# EasyEDA Pro project ProDoc_SAMID_2026-04-18.epro

# Schematic SAMID
Board Name: SAMID; Create Date: 2025-04-14; Page Name: SAMID; Project Name: SAMID_2025-04-14_12-44-47; Schematic Name: SAMID; Update Date: 2025-04-20; Add into BOM: yes; Company: Your Company; Convert to PCB: yes; Date: 2025-02-18; Draw By: jajasaludosjoselol; REV: 1.0; Sheet: 1/1; spicePre: .
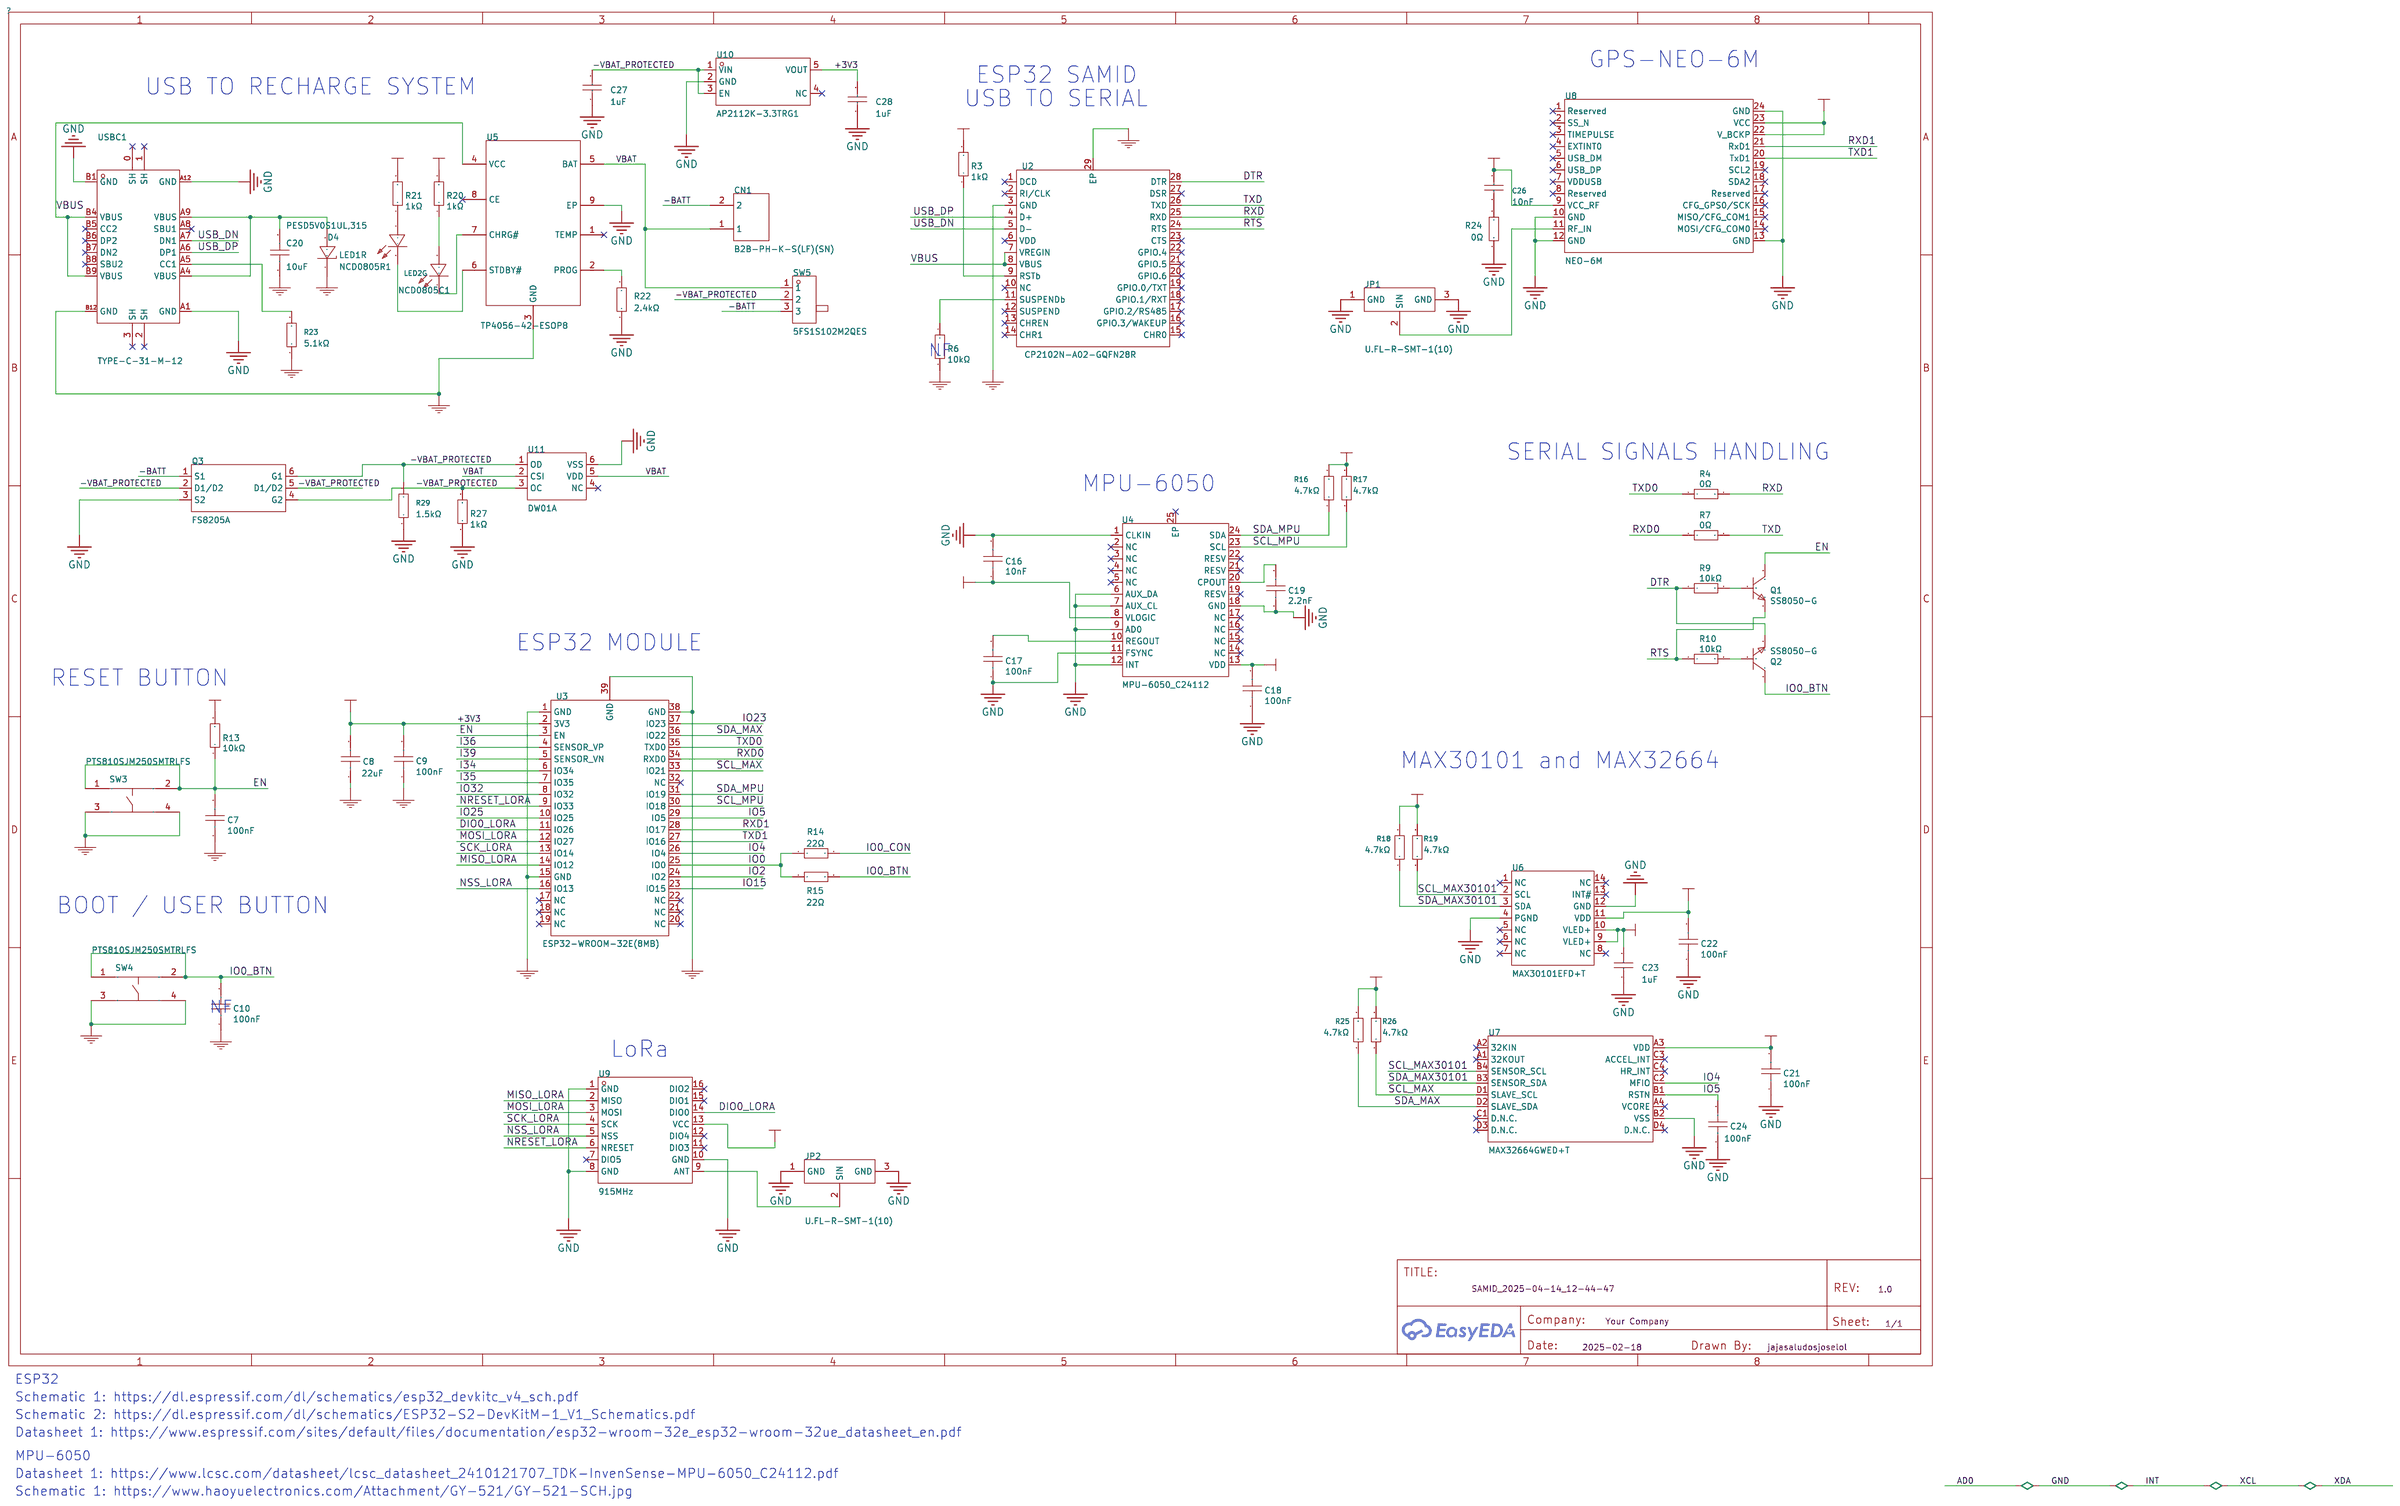
[diagram p0: schematic sheet]

## Parts
C7  100nF  [C0402]
C8  22uF  [C0805]
C9  100nF  [C0402]
C10  100nF  [C0402]
C16  10nF  [C0402]
C17  100nF  [C0402]
C18  100nF  [C0402]
C19  2.2nF  [C0402]
C20  10uF  [C0805]
C21  100nF  [C0402]
C22  100nF  [C0402]
C23  1uF  [C0603]
C24  100nF  [C0402]
C26  10nF  [C0603]
C27  1uF  [C0603]
C28  1uF  [C0603]
CN1  B2B-PH-K-S(LF)(SN)  [CONN-TH_B2B-PH-K-S]
D4  PESD5V0S1UL,315  [SOD-882_L1.0-W0.6-RD]
JP1  U.FL-R-SMT-1(10)  [ANT-SMD_UFL-R-SMT-1-10]
JP2  U.FL-R-SMT-1(10)  [ANT-SMD_UFL-R-SMT-1-10]
LED1R  NCD0805R1  [LED0805-R-RD]
LED2G  NCD0805C1  [LED0805-RD]
Q1  SS8050-G  [SOT-23-3_L2.9-W1.3-P1.90-LS2.4-BR]
Q2  SS8050-G  [SOT-23-3_L2.9-W1.3-P1.90-LS2.4-BR]
Q3  FS8205A  [SOT-23-6_L2.9-W1.6-P0.95-LS2.8-BR]
R3  1kΩ  [R0402]
R4  0Ω  [R0402]
R6  10kΩ  [R0402]
R7  0Ω  [R0402]
R9  10kΩ  [R0402]
R10  10kΩ  [R0402]
R13  10kΩ  [R0402]
R14  22Ω  [R0402]
R15  22Ω  [R0402]
R16  4.7kΩ  [R0402]
R17  4.7kΩ  [R0402]
R18  4.7kΩ  [R0402]
R19  4.7kΩ  [R0402]
R20  1kΩ  [R0402]
R21  1kΩ  [R0402]
R22  2.4kΩ  [R0402]
R23  5.1kΩ  [R0402]
R24  0Ω  [R0402]
R25  4.7kΩ  [R0402]
R26  4.7kΩ  [R0402]
R27  1kΩ  [R0402]
R29  1.5kΩ  [R0805]
SW3  PTS810SJM250SMTRLFS  [KEY-SMD_4P-L4.2-W3.2-P2.20-LS4.6]
SW4  PTS810SJM250SMTRLFS  [KEY-SMD_4P-L4.2-W3.2-P2.20-LS4.6]
SW5  5FS1S102M2QES  [SW-TH_5FS1S102M2QES]
U2  CP2102N-A02-GQFN28R  [QFN-28_L5.0-W5.0-P0.50-TL-EP3.3]
U3  ESP32-WROOM-32E(8MB)  [WIFI-SMD_ESP32-WROOM-32E]
U4  MPU-6050_C24112  [QFN-24_L4.0-W4.0-P0.50-TL-EP2.5_B04217]
U5  TP4056-42-ESOP8  [ESOP-8_L4.9-W3.9-P1.27-LS6.0-BL-EP]
U6  MAX30101EFD+T  [OESIP-14_L5.6-W3.3-P0.80-TL]
U7  MAX32664GWED+T  [WLP-16_L1.6-W1.6-R4-C4-P0.35-TL_MAX32664GWEA]
U8  NEO-6M  [GPSM-SMD_24P-L16.0-W12.2-P1.10]
U9  915MHz  [COMM-SMD_LORA1276-C1-915MHZ]
U10  AP2112K-3.3TRG1  [SOT-25-5_L2.9-W1.6-P0.95-LS2.8-BL]
U11  DW01A  [SOT-23-6_L2.9-W1.6-P0.95-LS2.8-BL]
USBC1  TYPE-C-31-M-12  [USB-C_SMD-TYPE-C-31-M-12]

## Library data of the parts
C7 C9 C10 C21 C22 C24 = 100nF: Supplier: LCSC; Manufacturer Part: CL05B104KO5NNNC; Manufacturer: SAMSUNG(三星); Supplier Part: C1525; JLCPCB Part Class: Basic Part; nameAlias: Value; spicePre: C; spiceSymbolName: CL05B104KO5NNNC
C8 = 22uF: Supplier: LCSC; Supplier Part: C602037; Manufacturer: SAMSUNG(三星); Manufacturer Part: CL21A226MAYNNNE; JLCPCB Part Class: Extended Part; nameAlias: Value; Contributor: LCSC; spicePre: C; spiceSymbolName: CL21A226MAYNNNE
C16 = 10nF: Supplier: LCSC; Supplier Part: C541370; Manufacturer: YAGEO(国巨); Manufacturer Part: CC0402KRX7R5BB103; JLCPCB Part Class: Extended Part; nameAlias: Value; Contributor: shahariyarmaraz; spicePre: C; spiceSymbolName: CC0402KRX7R5BB103
C17 C18 = 100nF: Supplier: LCSC; Manufacturer Part: CC0402KRX7R5BB104; Manufacturer: YAGEO(国巨); Supplier Part: C541406; JLCPCB Part Class: Extended Part; nameAlias: Value; Contributor: LCSC; spicePre: C; spiceSymbolName: CC0402KRX7R5BB104
C19 = 2.2nF: Supplier: LCSC; Supplier Part: C526947; Manufacturer: YAGEO(国巨); Manufacturer Part: CC0201KRX7R5BB222; JLCPCB Part Class: Extended Part; nameAlias: Value; Contributor: LCSC; spicePre: C; spiceSymbolName: CC0201KRX7R5BB222
C20 = CL21A106KAYNNNE_C15850: Capacitance: Tolerance:±10% Tolerance:±10% Voltage Rated: Temperature Coefficient:; LCSC Part Name: 10uF ±10% 25V; Supplier Part: C15850; Manufacturer: SAMSUNG(三星); Manufacturer Part: CL21A106KAYNNNE; Supplier Footprint: 0805; JLCPCB Part Class: Basic Part; Datasheet: https://atta.szlcsc.com/upload/public/pdf/source/20160218/1457707763339.pdf; Supplier: LCSC; Tolerance: ±10%
C23 C27 C28 = CL10A105KA8NNNC: Capacitance: Tolerance:±10% Tolerance:±10% Voltage Rated: Temperature Coefficient:; LCSC Part Name: 1uF ±10% 25V; Supplier Part: C5673; Manufacturer: SAMSUNG(三星); Supplier Footprint: 0603; JLCPCB Part Class: Extended Part; Datasheet: https://atta.szlcsc.com/upload/public/pdf/source/20160218/1457707763339.pdf; Supplier: LCSC; Tolerance: ±10%
C26 = CC0603KRX7R9BB103: Capacitance: Tolerance:±10% Tolerance:±10% Voltage Rated: Temperature Coefficient:; LCSC Part Name: 10nF ±10% 50V; Supplier Part: C100042; Manufacturer: YAGEO(国巨); Supplier Footprint: 0603; Datasheet: https://atta.szlcsc.com/upload/public/pdf/source/20181008/C309510_22F155564471FAF6A489F7D68F34234E.pdf; Supplier: LCSC; Tolerance: ±10%
CN1 = B2B-PH-K-S(LF)(SN): Pins Structure:1x2P Pitch:2mm Mounting Type:Direct Insert Reference Series:PH Number of Pins:2P Number of Rows:1 Number of PINs Per Row:2 Row Spacing:- Current Rating:2A Contact Material:Brass Contact Plating:Tin Operating Temperature:-25℃~+85℃ Operating; LCSC Part Name: 1x2P 间距:2mm 直插 系列:PH; Supplier Part: C131337; Manufacturer: JST; Supplier Footprint: 插件,P=2mm; JLCPCB Part Class: Extended Part; Datasheet: https://atta.szlcsc.com/upload/public/pdf/source/20171026/C131342_15089839687311058815.pdf; Supplier: LCSC; Pins Structure: 1x2P; Pitch: 2mm; Mounting Type: Direct Insert; Reference Series: PH; Number of Pins: 2P; Number of Rows: 1; Number of PINs Per Row: 2; Current Rating: 2A; Contact Material: Brass; Contact Plating: Tin; Operating Temperature: -25℃~+85℃; Voltage Rating: 100V; Plastic Material: PA66; Flame Retardant Rating: UL94V-0; Supplementary Features: K-leg punch; Color: White; Z-Height of the Board: 6mm; X-Length of Bottom Edge on Board (Spacing Line): 5.9mm; Y-Width of Bottom Edge on Board: 4.5mm
D4 = PESD5V0S1UL,315: polarity:Unidirectional Reverse Stand-Off Voltage (Vrwm):5V@Max Maximum Clamping Voltage:20V Peak Pulse Current (Ipp)@10/1000us:15A@8/20us Peak Pulse Power Dissipation (Ppp)@10/1000us:150W Breakdown Voltage:6.4V Type:TVS; Supplier Part: C85402; Manufacturer: Nexperia(安世); Supplier Footprint: SOD-882; JLCPCB Part Class: Extended Part; Datasheet: https://atta.szlcsc.com/upload/public/pdf/source/20191113/C456142_F14A4260CF3BEB8D903F5831E074AB74.pdf; Supplier: LCSC; polarity: Unidirectional; Reverse Stand-Off Voltage (Vrwm): 5V@Max; Maximum Clamping Voltage: 20V; Peak Pulse Current (Ipp)@10/1000us: 15A@8/20us; Peak Pulse Power Dissipation (Ppp)@10/1000us: 150W; Breakdown Voltage: 6.4V; Type: TVS
JP1 JP2 = U.FL-R-SMT-1(10): Connector Type:板端 Interface Type:内针 Number of Ports:1 Interface Diameter:2mm Interface Length/Height:1.25mm Frequency-Max:6GHz RF Series:IPEX Impedance:50Ω Style:- Contact Material:Brass Operating Temperature Range:-40℃~+90℃ Operating Temperature Range:-4; LCSC Part Name: IPEX 内针; Supplier Part: C88373; Manufacturer: HRS(广濑); Supplier Footprint: SMD; JLCPCB Part Class: Extended Part; Datasheet: https://atta.szlcsc.com/upload/public/pdf/source/20191010/C434816_11DAC26C7ED37A2D3E584E7DBDF6972E.pdf; Supplier: LCSC; Connector Type: 板端; Interface Type: 内针; Number of Ports: 1; Interface Diameter: 2mm; Interface Length/Height: 1.25mm; Frequency-Max: 6GHz; RF Series: IPEX; Impedance: 50Ω; Contact Material: Brass; Operating Temperature Range: -40℃~+90℃
LED1R = NCD0805R1_C84256: Lamp Holder Type:- Emitted Color:Red Forward Voltage (VF):1.6V~2.6V Forward Voltage (VF):1.6V~2.6V Power Dissipation:65mW Forward Current:20mA Dominant Wavelength:615nm~630nm Dominant Wavelength:615nm~630nm Peak Wavelength:- Diode Configuration:独立二极管 Lens; Supplier Part: C84256; Manufacturer: 国星光电; Supplier Footprint: 0805; JLCPCB Part Class: Basic Part; Datasheet: https://atta.szlcsc.com/upload/public/pdf/source/20200820/C84256_F0A75A43B3EAD75808600A0514C76B99.pdf; Supplier: LCSC; Emitted Color: Red; Forward Voltage (VF): 1.6V~2.6V; Power Dissipation: 65mW; Forward Current: 20mA; Dominant Wavelength: 615nm~630nm; Diode Configuration: 独立二极管; Lens Color: 无色透明透镜; Luminous Intensity: 67mcd~195mcd; Viewing Angle: 130°; Operating Temperature: -30℃~+85℃
LED2G = NCD0805C1: Emitted Color:Green-yellow Forward Voltage (VF):1.6V~2.6V Forward Voltage (VF):1.6V~2.6V Power Dissipation:65mW Forward Current:20mA Dominant Wavelength:565nm~578nm Dominant Wavelength:565nm~578nm Lens Color:无色透明透镜 Luminous Intensity:20mcd~55mcd Luminous; Supplier Part: C84257; Manufacturer: 国星光电; Supplier Footprint: 0805; Datasheet: https://atta.szlcsc.com/upload/public/pdf/source/20200820/C84257_8E1200BAE92C082055D96FC4159EE35B.pdf; Supplier: LCSC; Emitted Color: Green-yellow; Forward Voltage (VF): 1.6V~2.6V; Power Dissipation: 65mW; Forward Current: 20mA; Dominant Wavelength: 565nm~578nm; Lens Color: 无色透明透镜; Luminous Intensity: 20mcd~55mcd; Viewing Angle: 130°; Operating Temperature: -30℃~+85℃
Q1 Q2 = SS8050-G: Supplier: LCSC; Manufacturer: CJ(江苏长电/长晶); Manufacturer Part: SS8050-G(RANGE:120-200); Supplier Part: C164886; JLCPCB Part Class: Extended Part; Contributor: LCSC; spicePre: Q
Q3 = FS8205A_C908265: Type:2 N-Channel Drain to Source Voltage:20V Current - Continuous Drain(Id): RDS(on):18mΩ@4.5V,6A Pd - Power Dissipation:1.5W Gate Threshold Voltage (Vgs(th)@Id):1.2V Gate Charge(Qg):11nC@4.5V Input Capacitance(Ciss@Vds):800pF@8V Reverse Transfer Capacita; LCSC Part Name: 2个N沟道 耐压:20V 电流:6A; Supplier Part: C908265; Manufacturer: FUXINSEMI(富芯森美); Supplier Footprint: SOT-23-6L; JLCPCB Part Class: Extended Part; Datasheet: https://atta.szlcsc.com/upload/public/pdf/source/20201027/C908265_C6F1A5E0FB14735EF799FEF607A99450.pdf; Supplier: LCSC; Type: 2 N-Channel; Drain to Source Voltage: 20V; RDS(on): 18mΩ@4.5V,6A; Pd - Power Dissipation: 1.5W; Gate Threshold Voltage (Vgs(th)@Id): 1.2V; Gate Charge(Qg): 11nC@4.5V; Input Capacitance(Ciss@Vds): 800pF@8V; Reverse Transfer Capacitance (Crss@Vds): 125pF@8V; Operating Temperature: -55℃~+150℃@(Tj)
R3 R20 R21 R27 = 1kΩ: Supplier: LCSC; Manufacturer: UNI-ROYAL(厚声); Manufacturer Part: 0402WGF1001TCE; Supplier Part: C11702; JLCPCB Part Class: Basic Part; nameAlias: Value; spicePre: R; spiceSymbolName: 0402WGF1001TCE
R4 R7 R24 = 0Ω: Supplier: LCSC; Manufacturer: UNI-ROYAL(厚声); Manufacturer Part: 0402WGF0000TCE; Supplier Part: C17168; JLCPCB Part Class: Basic Part; nameAlias: Value; spicePre: R; spiceSymbolName: 0402WGF0000TCE
R6 R9 R10 R13 = 10kΩ: Supplier: LCSC; Manufacturer: UNI-ROYAL(厚声); Manufacturer Part: 0402WGF1002TCE; Supplier Part: C25744; JLCPCB Part Class: Basic Part; nameAlias: Value; spicePre: R; spiceSymbolName: 0402WGF1002TCE
R14 R15 = 22Ω: Supplier: LCSC; Manufacturer: UNI-ROYAL(厚声); Manufacturer Part: 0402WGF220JTCE; Supplier Part: C25092; JLCPCB Part Class: Basic Part; nameAlias: Value; spicePre: R; spiceSymbolName: 0402WGF220JTCE
R16-R19 R25 R26 = 0402WGF4701TCE: Type:Thick Film Resistors Resistance:4.7kΩ Tolerance:±1% Tolerance:±1% Power(Watts): Overload Voltage (Max): Temperature Coefficient:±100ppm/℃ Temperature Coefficient:±100ppm/℃ Operating Temperature Range:-55℃~+155℃ Operating Temperature Range:-55℃~+155℃; LCSC Part Name: 4.7kΩ ±1% 62.5mW 厚膜电阻; Supplier Part: C25900; Manufacturer: UNI-ROYAL(厚声); Supplier Footprint: 0402; JLCPCB Part Class: Basic Part; Datasheet: https://atta.szlcsc.com/upload/public/pdf/source/20200306/C422600_1E6D84923E4A46A82E41ADD87F860B5C.pdf; Supplier: LCSC; Type: Thick Film Resistors; Tolerance: ±1%; Temperature Coefficient: ±100ppm/℃; Operating Temperature Range: -55℃~+155℃
R22 = 0402WGF2401TCE: Type:Thick Film Resistors Resistance:2.4kΩ Tolerance:±1% Tolerance:±1% Power(Watts): Overload Voltage (Max): Temperature Coefficient:±100ppm/℃ Temperature Coefficient:±100ppm/℃ Operating Temperature Range:-55℃~+155℃ Operating Temperature Range:-55℃~+155℃; LCSC Part Name: 2.4kΩ ±1% 62.5mW 厚膜电阻; Supplier Part: C25882; Manufacturer: UNI-ROYAL(厚声); Supplier Footprint: 0402; JLCPCB Part Class: Extended Part; Datasheet: https://atta.szlcsc.com/upload/public/pdf/source/20200306/C422600_1E6D84923E4A46A82E41ADD87F860B5C.pdf; Supplier: LCSC; Type: Thick Film Resistors; Tolerance: ±1%; Temperature Coefficient: ±100ppm/℃; Operating Temperature Range: -55℃~+155℃
R23 = 0402WGF5101TCE: Type:Thick Film Resistors Resistance:5.1kΩ Tolerance:±1% Tolerance:±1% Power(Watts): Overload Voltage (Max): Temperature Coefficient:±100ppm/℃ Temperature Coefficient:±100ppm/℃ Operating Temperature Range:-55℃~+155℃ Operating Temperature Range:-55℃~+155℃; LCSC Part Name: 5.1kΩ ±1% 62.5mW 厚膜电阻; Supplier Part: C25905; Manufacturer: UNI-ROYAL(厚声); Supplier Footprint: 0402; JLCPCB Part Class: Basic Part; Datasheet: https://atta.szlcsc.com/upload/public/pdf/source/20200306/C422600_1E6D84923E4A46A82E41ADD87F860B5C.pdf; Supplier: LCSC; Type: Thick Film Resistors; Tolerance: ±1%; Temperature Coefficient: ±100ppm/℃; Operating Temperature Range: -55℃~+155℃
R29 = 0805W8F1501T5E: Type:Thick Film Resistors Resistance:1.5kΩ Tolerance:±1% Tolerance:±1% Power(Watts): Overload Voltage (Max): Temperature Coefficient:±100ppm/℃ Temperature Coefficient:±100ppm/℃ Operating Temperature Range:-55℃~+155℃ Operating Temperature Range:-55℃~+155℃; LCSC Part Name: 1.5kΩ ±1% 125mW 厚膜电阻; Supplier Part: C4310; Manufacturer: UNI-ROYAL(厚声); Supplier Footprint: 0805; JLCPCB Part Class: Basic Part; Datasheet: https://atta.szlcsc.com/upload/public/pdf/source/20200306/C422600_1E6D84923E4A46A82E41ADD87F860B5C.pdf; Supplier: LCSC; Type: Thick Film Resistors; Tolerance: ±1%; Temperature Coefficient: ±100ppm/℃; Operating Temperature Range: -55℃~+155℃
SW3 SW4 = PTS810SJM250SMTRLFS: Circuit:SPST Actuator Style:Round Button Operating Force:160gf Mounting Style:Standing paste Switch Length:4.2mm Switch Width:3.2mm Switch Height:2.5mm Contact Current:50mA Voltage Rating (DC):16V With Lamp:- Pin Style:J-pin Mechanical Life:- Operating Te; LCSC Part Name: 4.2*3.2*2.5mm 立贴 轻触开关; Supplier Part: C116501; Manufacturer: C&K; Supplier Footprint: SMD; JLCPCB Part Class: Extended Part; Datasheet: https://atta.szlcsc.com/upload/public/pdf/source/20180613/C221897_9316320DEFA4333FA0E6C5D565B0D5EA.pdf; Supplier: LCSC; Circuit: SPST; Actuator Style: Round Button; Operating Force: 160gf; Mounting Style: Standing paste; Switch Length: 4.2mm; Switch Width: 3.2mm; Switch Height: 2.5mm; Contact Current: 50mA; Voltage Rating (DC): 16V; Pin Style: J-pin; Operating Temperature: -40℃~+85℃
SW5 = 5FS1S102M2QES: Circuit:SPDT Actuator Style:Rectangular columnar Pin Style:PCPin Switch Length:10.16mm Switch Width:5.08mm Switch Height:12.3mm Mounting Style:Straight Actuator Color:Black Mechanical Life:3万次 Operating Temperature:-40℃~+85℃ Operating Temperature:-40℃~+85; Supplier Part: C496206; Manufacturer: Dailywell(德利威); Supplier Footprint: 插件; Datasheet: https://atta.szlcsc.com/upload/public/pdf/source/20200313/C496206_DC1865DE3D5FFC50ED6599790D46CA56.pdf; Supplier: LCSC; Circuit: SPDT; Actuator Style: Rectangular columnar; Pin Style: PCPin; Switch Length: 10.16mm; Switch Width: 5.08mm; Switch Height: 12.3mm; Mounting Style: Straight; Actuator Color: Black; Mechanical Life: 3万次; Operating Temperature: -40℃~+85℃
U2 = CP2102N-A02-GQFN28R: Supplier: LCSC; Supplier Part: C964632; Manufacturer: SKYWORKS/SILICON LABS(芯科); JLCPCB Part Class: Extended Part; Contributor: LCSC; spicePre: U
U3 = ESP32-WROOM-32E(8MB): Supplier: LCSC; Supplier Part: C701342; Manufacturer: ESPRESSIF(乐鑫); Manufacturer Part: ESP32-WROOM-32E-N8; JLCPCB Part Class: Extended Part; Contributor: LCSC; spicePre: U
U4 = MPU-6050_C24112: Supplier: LCSC; Manufacturer: TDK InvenSense(应美盛); Manufacturer Part: MPU-6050; Supplier Part: C24112; JLCPCB Part Class: Extended Part; sourceId: 1T5FDZYC8; timeStamp: 1462265206; spicePre: U
U5 = TP4056-42-ESOP8: Supplier Part: C16581; Manufacturer: TOPPOWER(南京拓微); Supplier Footprint: ESOP-8; JLCPCB Part Class: Extended Part; Datasheet: https://atta.szlcsc.com/upload/public/pdf/source/20190626/C16581_611BCF5D7CF554EAE465137A8F68DB3E.pdf; Supplier: LCSC
U6 = MAX30101EFD+T: Operating Temperature:-40℃~+85℃ Operating Temperature:-40℃~+85℃; LCSC Part Name: I2C接口的脉搏血氧计和心率传感器IC; Supplier Part: C2859066; Manufacturer: ADI(亚德诺)/MAXIM(美信); Supplier Footprint: OLGA-14(3.3x5.6); JLCPCB Part Class: Extended Part; Datasheet: https://atta.szlcsc.com/upload/public/pdf/source/20221219/A83A6B2BE3828C2A438FF2EEAED7B281.pdf; Supplier: LCSC; Operating Temperature: -40℃~+85℃
U7 = MAX32664GWED+T: Sensor Type:Biometric sensor; Supplier Part: C17303188; Manufacturer: ADI(亚德诺)/MAXIM(美信); Supplier Footprint: WLP-16(1.55x1.57); JLCPCB Part Class: Extended Part; Datasheet: https://atta.szlcsc.com/upload/public/pdf/source/20230919/948331337EB1F4573579C3465AC34D43.pdf; Supplier: LCSC; Sensor Type: Biometric sensor
U8 = NEO-6M: Supplier Part: C2927633; JLCPCB Part Class: Extended Part; Supplier: LCSC
U9 = lora1276-C1-915MHz: Frequency:915MHz; LCSC Part Name: 915MHz无线模块; Supplier Part: C3001531; Manufacturer: G-NiceRF(思为无线); Supplier Footprint: SMD,16x16mm; JLCPCB Part Class: Extended Part; Datasheet: https://atta.szlcsc.com/upload/public/pdf/source/20220425/530C73F5612432B98CDC262676D34B0B.pdf; Supplier: LCSC
U10 = AP2112K-3.3TRG1: Output Type:Fixed Maximum Input Voltage:6V Output Voltage:3.3V Output Voltage:3.3V Output Current:600mA Power Supply Rejection Ratio (PSRR):65dB@(1kHz) Dropout Voltage:400mV@(600mA) standby current:80uA Feature:ESD Protection；Automatic Discharge Function；; LCSC Part Name: 输入6V 输出3.3V 600mA; Supplier Part: C51118; Manufacturer: DIODES(美台); Supplier Footprint: SOT-25-5; JLCPCB Part Class: Extended Part; Datasheet: https://atta.szlcsc.com/upload/public/pdf/source/20171221/C51118_15138312998391195590.pdf; Supplier: LCSC; Output Type: Fixed; Maximum Input Voltage: 6V; Output Voltage: 3.3V; Output Current: 600mA; Power Supply Rejection Ratio (PSRR): 65dB@(1kHz); Dropout Voltage: 400mV@(600mA); standby current: 80uA; Feature: ESD Protection；Automatic Discharge Function；Low ESR；Thermal Protection(TSD)；Overcurrent Protection(OCP)；With ability; Operating Temperature: -40℃~+85℃; Output Polarity: Positive electrode; Number of Outputs: 1
U11 = DW01A_C2927799: The Chip Type:Battery Protection Chip Voltage - Supply:-300mV~8V Voltage - Supply:-300mV~8V Charge Current - Max:- Charging Saturation Voltage:- End-Off Voltage:- Type of Battery:Lithium-ion/Polymer Number of Cells:1 Number of Cells:1 Operating Temperatur; Supplier Part: C2927799; Manufacturer: YONGYUTAI(永裕泰); Supplier Footprint: SOT-23-6; JLCPCB Part Class: Extended Part; Datasheet: https://atta.szlcsc.com/upload/public/pdf/source/20211207/8DC9CB9A742765EFB66910D35511359F.pdf; Supplier: LCSC; The Chip Type: Battery Protection Chip; Voltage - Supply: -300mV~8V; Type of Battery: Lithium-ion/Polymer; Number of Cells: 1; Operating Temperature: -40℃~+85℃
USBC1 = TYPE-C-31-M-12: Connector Type:Type-C Standard:- Gender:Female Mounting Style:- Number of Contacts:16P Number of Ports:1 Current Rating - Power (Max):5A Operating Temperature Range:- Operating Temperature Range:-; LCSC Part Name: Type-C 母; Supplier Part: C165948; Manufacturer: 韩国韩荣; Supplier Footprint: SMD; Datasheet: https://atta.szlcsc.com/upload/public/pdf/source/20220525/466408E853115E789EDB0DDC29077C05.pdf; Supplier: LCSC; Connector Type: Type-C; Gender: Female; Number of Contacts: 16P; Number of Ports: 1; Current Rating - Power (Max): 5A

## Nets
+3V3: C8.2 C9.2 C16.1 C18.2 C21.2 C22.2 C23.2 C26.2 C28.2 R3.2 R13.2 R16.2 R17.2 R18.2 R19.2 R25.2 R26.2 U3.2(3V3) U4.8(VLOGIC) U4.13(VDD) U6.9(VLED+) U6.10(VLED+) U6.11(VDD) U7.A3(VDD) U8.9(VCC_RF) U8.22(V_BCKP) U8.23(VCC) U9.13(VCC) U10.5(VOUT)
-VBAT_PROTECTED: C27.2 Q3.2(D1/D2) Q3.4(G2) Q3.5(D1/D2) Q3.6(G1) R27.2 R29.2 SW5.2 U10.1(VIN) U10.3(EN) U11.1(OD) U11.3(OC)
GND: C7.1 C8.1 C9.1 C10.1 C16.2 C17.1 C18.1 C19.1 C20.1 C21.1 C22.1 C23.1 C24.1 C27.1 C28.1 D4.1(C) JP1.1(GND) JP1.3(GND) JP2.1(GND) JP2.3(GND) Q3.3(S2) R6.2 R22.1 R23.1 R24.1 R27.1 R29.1 SW3.3 SW3.4 SW4.3 SW4.4 U2.3(GND) U2.29(EP) U3.1(GND) U3.15(GND) U3.38(GND) U3.39(GND) U4.1(CLKIN) U4.6(AUX_DA) U4.7(AUX_CL) U4.9(AD0) U4.11(FSYNC) U4.12(INT) U4.18(GND) U5.3(GND) U5.9(EP) U6.4(PGND) U6.12(GND) U7.B2(VSS) U8.10(GND) U8.12(GND) U8.13(GND) U8.24(GND) U9.1(GND) U9.8(GND) U9.10(GND) U10.2(GND) U11.6(VSS) USBC1.A1(GND) USBC1.A12(GND) USBC1.B1(GND) USBC1.B12(GND)
VBAT: CN1.1 SW5.1 U5.5(BAT) U11.2(CSI) U11.5(VDD)
VBUS: R20.2 R21.2 U2.7(VREGIN) U2.8(VBUS) U5.4(VCC) USBC1.B4(VBUS) USBC1.B9(VBUS)
-BATT: CN1.2 Q3.1(S1) SW5.3
DIO0_LORA: U3.11(IO26) U9.14(DIO0)
DTR: Q2.2(E) R9.1 U2.28(DTR)
EN: C7.2 Q1.3(C) R13.1 SW3.1 SW3.2 U3.3(EN)
I34: U3.6(IO34)
I35: U3.7(IO35)
I36: U3.4(SENSOR_VP)
I39: U3.5(SENSOR_VN)
IO0: R14.1 R15.1 U3.25(IO0)
IO0_BTN: C10.2 Q2.3(C) R15.2 SW4.1 SW4.2
IO0_CON: R14.2
IO2: U3.24(IO2)
IO4: U3.26(IO4) U7.C2(MFIO)
IO5: C24.2 U3.29(IO5) U7.B1(RSTN)
IO15: U3.23(IO15)
IO23: U3.37(IO23)
IO25: U3.10(IO25)
IO32: U3.8(IO32)
MISO_LORA: U3.14(IO12) U9.2(MISO)
MOSI_LORA: U3.12(IO27) U9.3(MOSI)
NRESET_LORA: U3.9(IO33) U9.6(NRESET)
NSS_LORA: U3.16(IO13) U9.5(NSS)
RTS: Q1.2(E) R10.1 U2.24(RTS)
RXD: R4.2 U2.25(RXD)
RXD0: R7.1 U3.34(RXD0)
RXD1: U3.28(IO17) U8.21(RxD1)
SCK_LORA: U3.13(IO14) U9.4(SCK)
SCL_MAX: R26.1 U3.33(IO21) U7.D1(SLAVE_SCL)
SCL_MAX30101: R19.1 U6.2(SCL) U7.B4(SENSOR_SCL)
SCL_MPU: R17.1 U3.30(IO18) U4.23(SCL)
SDA_MAX: R25.1 U3.36(IO22) U7.D2(SLAVE_SDA)
SDA_MAX30101: R18.1 U6.3(SDA) U7.B3(SENSOR_SDA)
SDA_MPU: R16.1 U3.31(IO19) U4.24(SDA)
TXD: R7.2 U2.26(TXD)
TXD0: R4.1 U3.35(TXD0)
TXD1: U3.27(IO16) U8.20(TxD1)
USB_DN: U2.5(D-) USBC1.A7(DN1)
USB_DP: U2.4(D+) USBC1.A6(DP1)
Net-(C17-2): C17.2 U4.10(REGOUT)
Net-(C19-2): C19.2 U4.20(CPOUT)
Net-(C20-2): C20.2 D4.2(A) USBC1.A4(VBUS) USBC1.A9(VBUS)
Net-(C26-1): C26.1 R24.2
Net-(JP1-2): JP1.2(SIN) U8.11(RF_IN)
Net-(JP2-2): JP2.2(SIN) U9.9(ANT)
Net-(LED1R-1): LED1R.1(+) R21.1
Net-(LED1R-2): LED1R.2(-) U5.6(STDBY#)
Net-(LED2G-1): LED2G.1(K) U5.7(CHRG#)
Net-(LED2G-2): LED2G.2(A) R20.1
Net-(Q1-1): Q1.1(B) R9.2
Net-(Q2-1): Q2.1(B) R10.2
Net-(R3-1): R3.1 U2.9(RSTb)
Net-(R6-1): R6.1 U2.11(SUSPENDb)
Net-(R22-2): R22.2 U5.2(PROG)
Net-(R23-2): R23.2 USBC1.A5(CC1)

Not connected (* = marked no-connect by the designer): U2 1(DCD)* 2(RI/CLK)* 6(VDD)* 10(NC)* 12(SUSPEND)* 13(CHREN)* 14(CHR1)* 15(CHR0)* 16(GPIO.3/WAKEUP)* 17(GPIO.2/RS485)* 18(GPIO.1/RXT)* 19(GPIO.0/TXT)* 20(GPIO.6)* 21(GPIO.5)* 22(GPIO.4)* 23(CTS)* 27(DSR)*; U3 17(NC)* 18(NC)* 19(NC)* 20(NC)* 21(NC)* 22(NC)* 32(NC)*; U4 2(NC)* 3(NC)* 4(NC)* 5(NC)* 14(NC)* 15(NC)* 16(NC)* 17(NC)* 19(RESV)* 21(RESV)* 22(RESV)* 25(EP)*; U5 1(TEMP)* 8(CE)*; U6 1(NC)* 5(NC)* 6(NC)* 7(NC)* 8(NC)* 13(INT#)* 14(NC)*; U7 A1(32KOUT)* A2(32KIN)* A4(VCORE)* C1(D.N.C.)* C3(ACCEL_INT)* C4(HR_INT)* D3(D.N.C.)* D4(D.N.C.)*; U8 1(Reserved)* 2(SS_N)* 3(TIMEPULSE)* 4(EXTINT0)* 5(USB_DM)* 6(USB_DP)* 7(VDDUSB)* 8(Reserved)* 14(MOSI/CFG_COM0)* 15(MISO/CFG_COM1)* 16(CFG_GPS0/SCK)* 17(Reserved)* 18(SDA2)* 19(SCL2)*; U9 7(DIO5)* 11(DIO3)* 12(DIO4)* 15(DIO1)* 16(DIO2)*; U10 4(NC)*; U11 4(NC)*; USBC1 0(SH)* 1(SH)* 2(SH)* 3(SH)* A8(SBU1)* B5(CC2)* B6(DP2)* B7(DN2)* B8(SBU2)*

## Notes on the sheet
- GPS-NEO-6M
- ESP32 SAMID
- USB TO RECHARGE SYSTEM
- USB TO SERIAL
- NF
- SERIAL SIGNALS HANDLING
- MPU-6050
- ESP32 MODULE
- RESET BUTTON
- MAX30101 and MAX32664
- BOOT / USER BUTTON
- NF
- LoRa
- ESP32
- Schematic 1: https://dl.espressif.com/dl/schematics/esp32_devkitc_v4_sch.pdf
- Schematic 2: https://dl.espressif.com/dl/schematics/ESP32-S2-DevKitM-1_V1_Schematics.pdf
- Datasheet 1: https://www.espressif.com/sites/default/files/documentation/esp32-wroom-32e_esp32-wroom-32ue_datasheet_en.pdf
- MPU-6050
- Datasheet 1: https://www.lcsc.com/datasheet/lcsc_datasheet_2410121707_TDK-InvenSense-MPU-6050_C24112.pdf
- Schematic 1: https://www.haoyuelectronics.com/Attachment/GY-521/GY-521-SCH.jpg
